# Altium schematic sheet aafilter.SCHDOC
size B
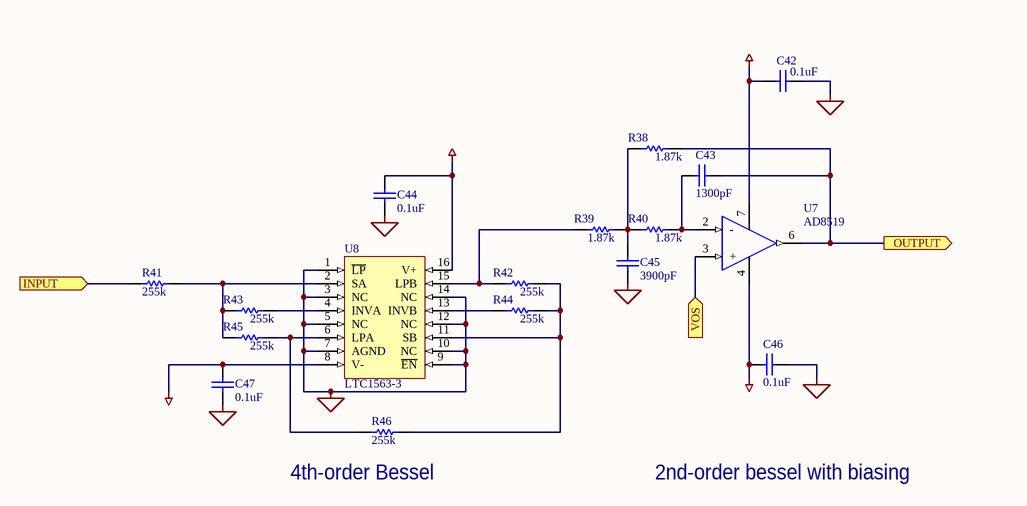
[diagram p0: aafilter.SCHDOC]

## Parts
C42  value 0.1uF  [CC1608-0603]  (hidden comment: Cap)
C43  value 1300pF  [CC1608-0603]  (hidden comment: Cap)
C44  value 0.1uF  [CC1608-0603]  (hidden comment: Cap)
C45  value 3900pF  [CC1608-0603]  (hidden comment: Cap)
C46  value 0.1uF  [CC1608-0603]  (hidden comment: Cap)
C47  value 0.1uF  [CC1608-0603]  (hidden comment: Cap)
R38  value 1.87k  [R2012-0805]  (hidden comment: Res1)
R39  value 1.87k  [R2012-0805]  (hidden comment: Res1)
R40  value 1.87k  [R2012-0805]  (hidden comment: Res1)
R41  value 255k  [R2012-0805]  (hidden comment: Res1)
R42  value 255k  [R2012-0805]  (hidden comment: Res1)
R43  value 255k  [R2012-0805]  (hidden comment: Res1)
R44  value 255k  [R2012-0805]  (hidden comment: Res1)
R45  value 255k  [R2012-0805]  (hidden comment: Res1)
R46  value 255k  [R2012-0805]  (hidden comment: Res1)
U7  AD8519  [SO-G8/X.6]
U8  LTC1563-3  [SSO-G16/X.4]

## Ports
INPUT (in), OUTPUT (out), VOS (in)

## Nets
AVDD: C42.2 C44.2 U7.7(+Vs) U8.16(V+)
AVSS: C46.2 C47.2 U7.4(-Vs) U8.8(V-)
GND: C42.1 C44.1 C45.1 C46.1 C47.1 U8.1(~{LP}) U8.3(NC) U8.5(NC) U8.7(AGND) U8.9(~{EN}) U8.10(NC) U8.12(NC) U8.14(NC)
INPUT: R41.1 ; port INPUT
OUTPUT: C43.1 R38.2 U7.6(Out) ; port OUTPUT
VOS: U7.3(+) ; port VOS
NetC43_2: C43.2 R40.2 U7.2(-)
NetC45_2: C45.2 R38.1 R39.2 R40.1
NetR39_1: R39.1 R42.1 U8.15(LPB)
NetR41_2: R41.2 R43.1 R45.1 U8.2(SA)
NetR42_2: R42.2 R44.2 R46.2 U8.11(SB)
NetR43_2: R43.2 U8.4(INVA)
NetR44_1: R44.1 U8.13(INVB)
NetR45_2: R45.2 R46.1 U8.6(LPA)

## Notes on the sheet
- (near R46) 4th-order Bessel
- 2nd-order bessel with biasing

## Library data of the parts
C42-C47 = Cap: Capacitor; Manufacturer: Generic Components; Class I: Passive; Published: 8-Jun-2000; Revision: July-2002: Re-released for DXP Platform.; Publisher: Altium Limited; Class II: Capacitor
R38-R46 = Res1: Resistor; Manufacturer: Generic Components; Class I: Passive; Published: 8-Jun-2000; Revision: July-2002: Re-released for DXP Platform.; Publisher: Altium Limited; Class II: Resistor
U7 = AD8519: 8 MHz RRIO Op-Amp
U8 = LTC1563-3: Linear Tech 4-th order linear continuous filter